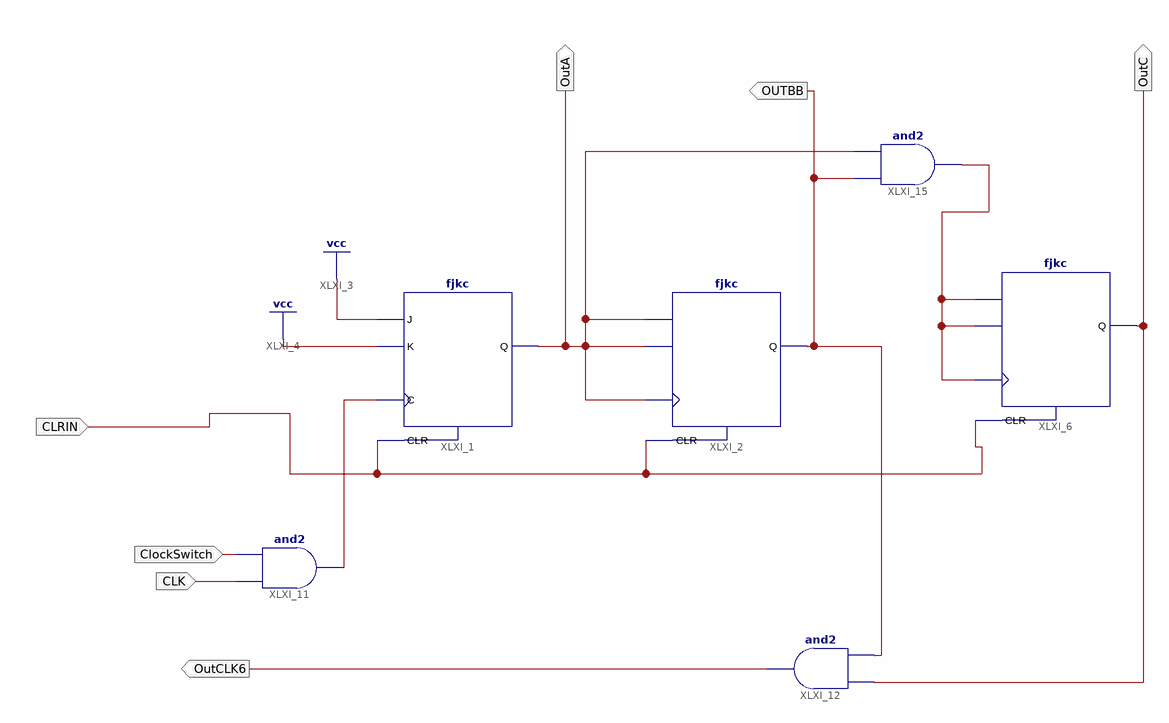
[diagram p0: schematic sheet 1]
// Xilinx ISE schematic counter16_async.sch (spartan6) as structural Verilog: 6 symbols, 7 ports
module counter16_async (
  input  ClockSwitch,
  input  CLK,
  input  CLRIN,
  output OutCLK6,
  output OutA,
  output OutC,
  output OUTBB
);

  wire OutB, XLXN_7;

  fjkc XLXI_1 (.C(XLXN_7), .CLR(CLRIN), .J(1'b1), .K(1'b1), .Q(OutA));
  fjkc XLXI_6 (.C(OutB), .CLR(CLRIN), .J(OutB), .K(OutB), .Q(OutC));
  and XLXI_11 (XLXN_7, CLK, ClockSwitch);
  and XLXI_12 (OutCLK6, OUTBB, OutC);
  fjkc XLXI_2 (.C(OutA), .CLR(CLRIN), .J(OutA), .K(OutA), .Q(OUTBB));
  and XLXI_15 (OutB, OUTBB, OutA);
endmodule
